# EAGLE design Rain_Gauge_PCB_V2 (EAGLE 9.5.2)
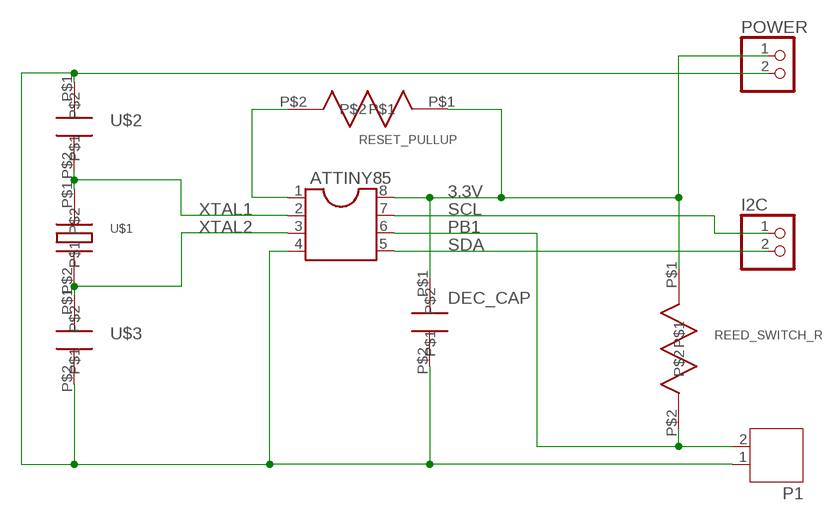
[diagram p0: schematic, sheet 1]

## Parts
ATTINY85  DIL8  [DIL08]
DEC_CAP  0603YC104KAZ2A  [0603YC104KAZ2A]
I2C  PINHD-1X2  [1X02]
P1  JST-PH2  [JST-PH2]
POWER  PINHD-1X2  [1X02]
REED_SWITCH_R  RK73B2ATTD103J  [RK73B2ATTD103J]
RESET_PULLUP  RK73B2ATTD103J  [RK73B2ATTD103J]
U$1  QCL16.0000F18B23B  [QCL16.0000F18B23B]
U$2  C0805C180J5GACTU  [C0805C180J5GACTU]
U$3  C0805C180J5GACTU  [C0805C180J5GACTU]

## Nets
3.3V: ATTINY85.8 DEC_CAP.P$1 POWER.1 REED_SWITCH_R.P$1 RESET_PULLUP.P$1
GND: ATTINY85.4 DEC_CAP.P$2 P1.1 POWER.2 U$2.P$1 U$3.P$2
PB1: ATTINY85.6 P1.2 REED_SWITCH_R.P$2
RESET: ATTINY85.1 RESET_PULLUP.P$2
SCL: ATTINY85.7 I2C.1
SDA: ATTINY85.5 I2C.2
XTAL1: ATTINY85.2 U$1.P$1 U$2.P$2
XTAL2: ATTINY85.3 U$1.P$2 U$3.P$1

## Library data of the parts
ATTINY85 = ic-package:DIL8: Dual In Line / Socket
DEC_CAP = Library:0603YC104KAZ2A: 100 nF 16 V Multilayer Ceramic Capacitor
I2C POWER = pinhead:PINHD-1X2: PIN HEADER
P1 = jst-ph:JST-PH2
REED_SWITCH_R RESET_PULLUP = Library:RK73B2ATTD103J: 10 Kohm 0.25 W
U$1 = Library:QCL16.0000F18B23B: 16 MHz Crystal
U$2 U$3 = Library:C0805C180J5GACTU: 18 pF 50 V Multilayer Ceramic Capacitor

## Board
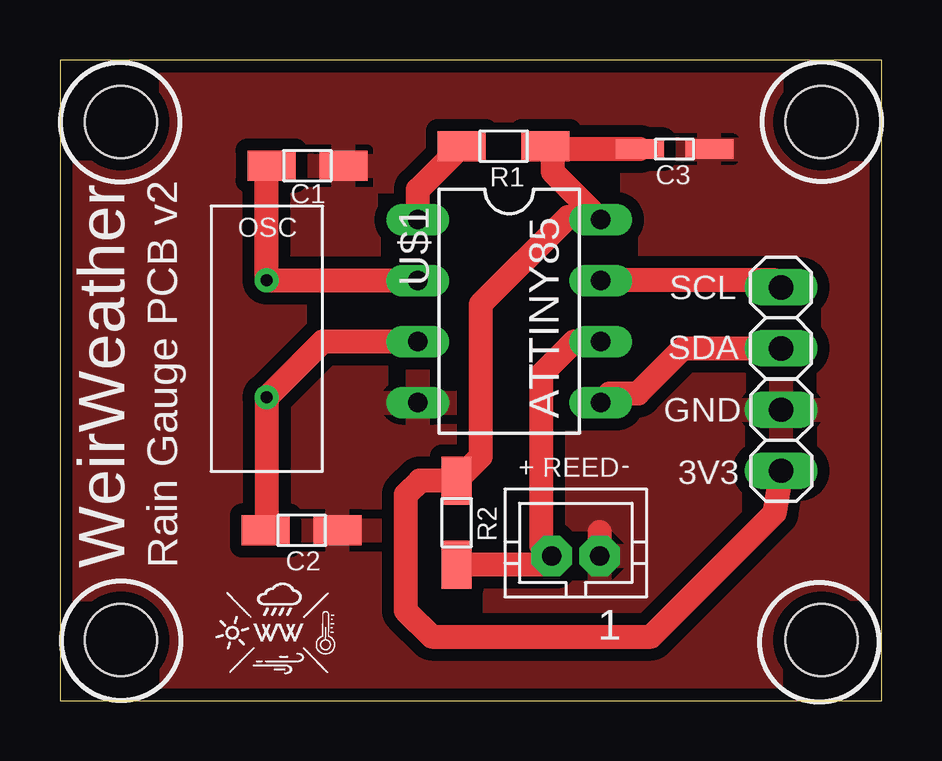
[diagram p1: board, top side]

Size 34.27 x 26.7 mm. Coordinates in mm from the lower left corner, seen from the top.
Outline: 0,0 34.27,0 34.27,26.7 0,26.7 0,0
Copper layers (1*16): Top 0.035mm / dielectric 1.5mm / Bottom 0.035mm
Design rules "default *": minimum track width 1mm, minimum drill 0.35mm, track to track 0.5mm, track to pad 0.5mm, pad to pad 0.5mm, via to via 0.5mm, smd to smd 0.5mm, copper to edge 20mil, drill to drill 6mil, minimum pad ring 10mil, minimum via ring 8mil, stop-mask expansion 4mil, vias tented up to drill 0mil, thermal gap 10mil
Holes 3 mm at 2.54,2.54 31.75,2.54 31.75,24.11 2.54,24.11

### Footprints (pad centres in the part's own frame; a part is rotated, then mirrored left to right if it is on the bottom)
DIL08 = drill 0.813 long: 1 -3.81,-3.81; 2 -1.27,-3.81; 3 1.27,-3.81; 4 3.81,-3.81; 5 3.81,3.81; 6 1.27,3.81; 7 -1.27,3.81; 8 -3.81,3.81
0603YC104KAZ2A = smd 2 x 0.81: P$1 -1.45,0; P$2 1.45,0
1X02 = drill 1.016 long: 1 -1.27,0; 2 1.27,0
JST-PH2 = drill 0.813 pad 1.676 octagon: 1 1,0; 2 -1,0
RK73B2ATTD103J = smd 2 x 1.25: P$1 -1.75,0; P$2 1.75,0
QCL16.0000F18B23B = drill 0.5: P$1 -2.44,0; P$2 2.44,0
C0805C180J5GACTU = smd 2 x 1.25: P$1 -1.5,0; P$2 1.5,0

### Placement (x,y rotation side)
ATTINY85  18.73,16.24 270 top
DEC_CAP  25.62,22.99 0 top
I2C  30.06,15.96 270 top
P1  21.5,6.04 0 top
POWER  30.07,10.86 90 top
REED_SWITCH_R  16.54,7.43 270 top
RESET_PULLUP  18.49,23.12 180 top
U$1  8.62,15.09 270 top
U$2  10.31,22.3 180 top
U$3  10.08,7.11 0 top

### Tracks (layer width: path | path; a pad name or v marks a point on that pad's centre or on a via)
3.3V
  Top 1: POWER.1 29.79,7.83 24.64,2.68 15.5,2.68 14.41,3.77 14.41,8.59 15,9.18 REED_SWITCH_R.P$1 17.54,10.18 17.54,16.52 21.19,20.17 22.42,20.17 ATTINY85.8 20.54,22.05 20.54,22.82 RESET_PULLUP.P$1 20.37,22.99 DEC_CAP.P$1
GND
  Top 1: P1.1 22.5,7.04
  pour Top: 0,26.54 34.5,26.54 34.5,0.04 0,0.04
PB1
  Top 1: ATTINY85.6 21.43,14.97 20.06,13.6 20.06,6.48 P1.2 20.14,5.68 REED_SWITCH_R.P$2
RESET
  Top 1: ATTINY85.1 14.92,21.3 RESET_PULLUP.P$2
SCL
  Top 1: ATTINY85.7 22.57,17.54 29.75,17.54 I2C.1
SDA
  Top 1: ATTINY85.5 22.92,12.81 24.09,12.81 25.97,14.69 I2C.2
XTAL1
  Top 1: 14.9,17.53 ATTINY85.2 8.64,17.51 U$1.P$1 8.62,22.11 U$2.P$2
XTAL2
  Top 1: U$3.P$1 8.62,7.15 U$1.P$2 10.95,14.97 ATTINY85.3

### Text on the board
tNames: C3 | C1 | R1 | OSC | SCL | SDA | GND | 3V3 | + | REED | - | R2 | WeirWeather | Rain Gauge PCB v2 | C2